# EAGLE design PecanPico6 (EAGLE 7.3.0)
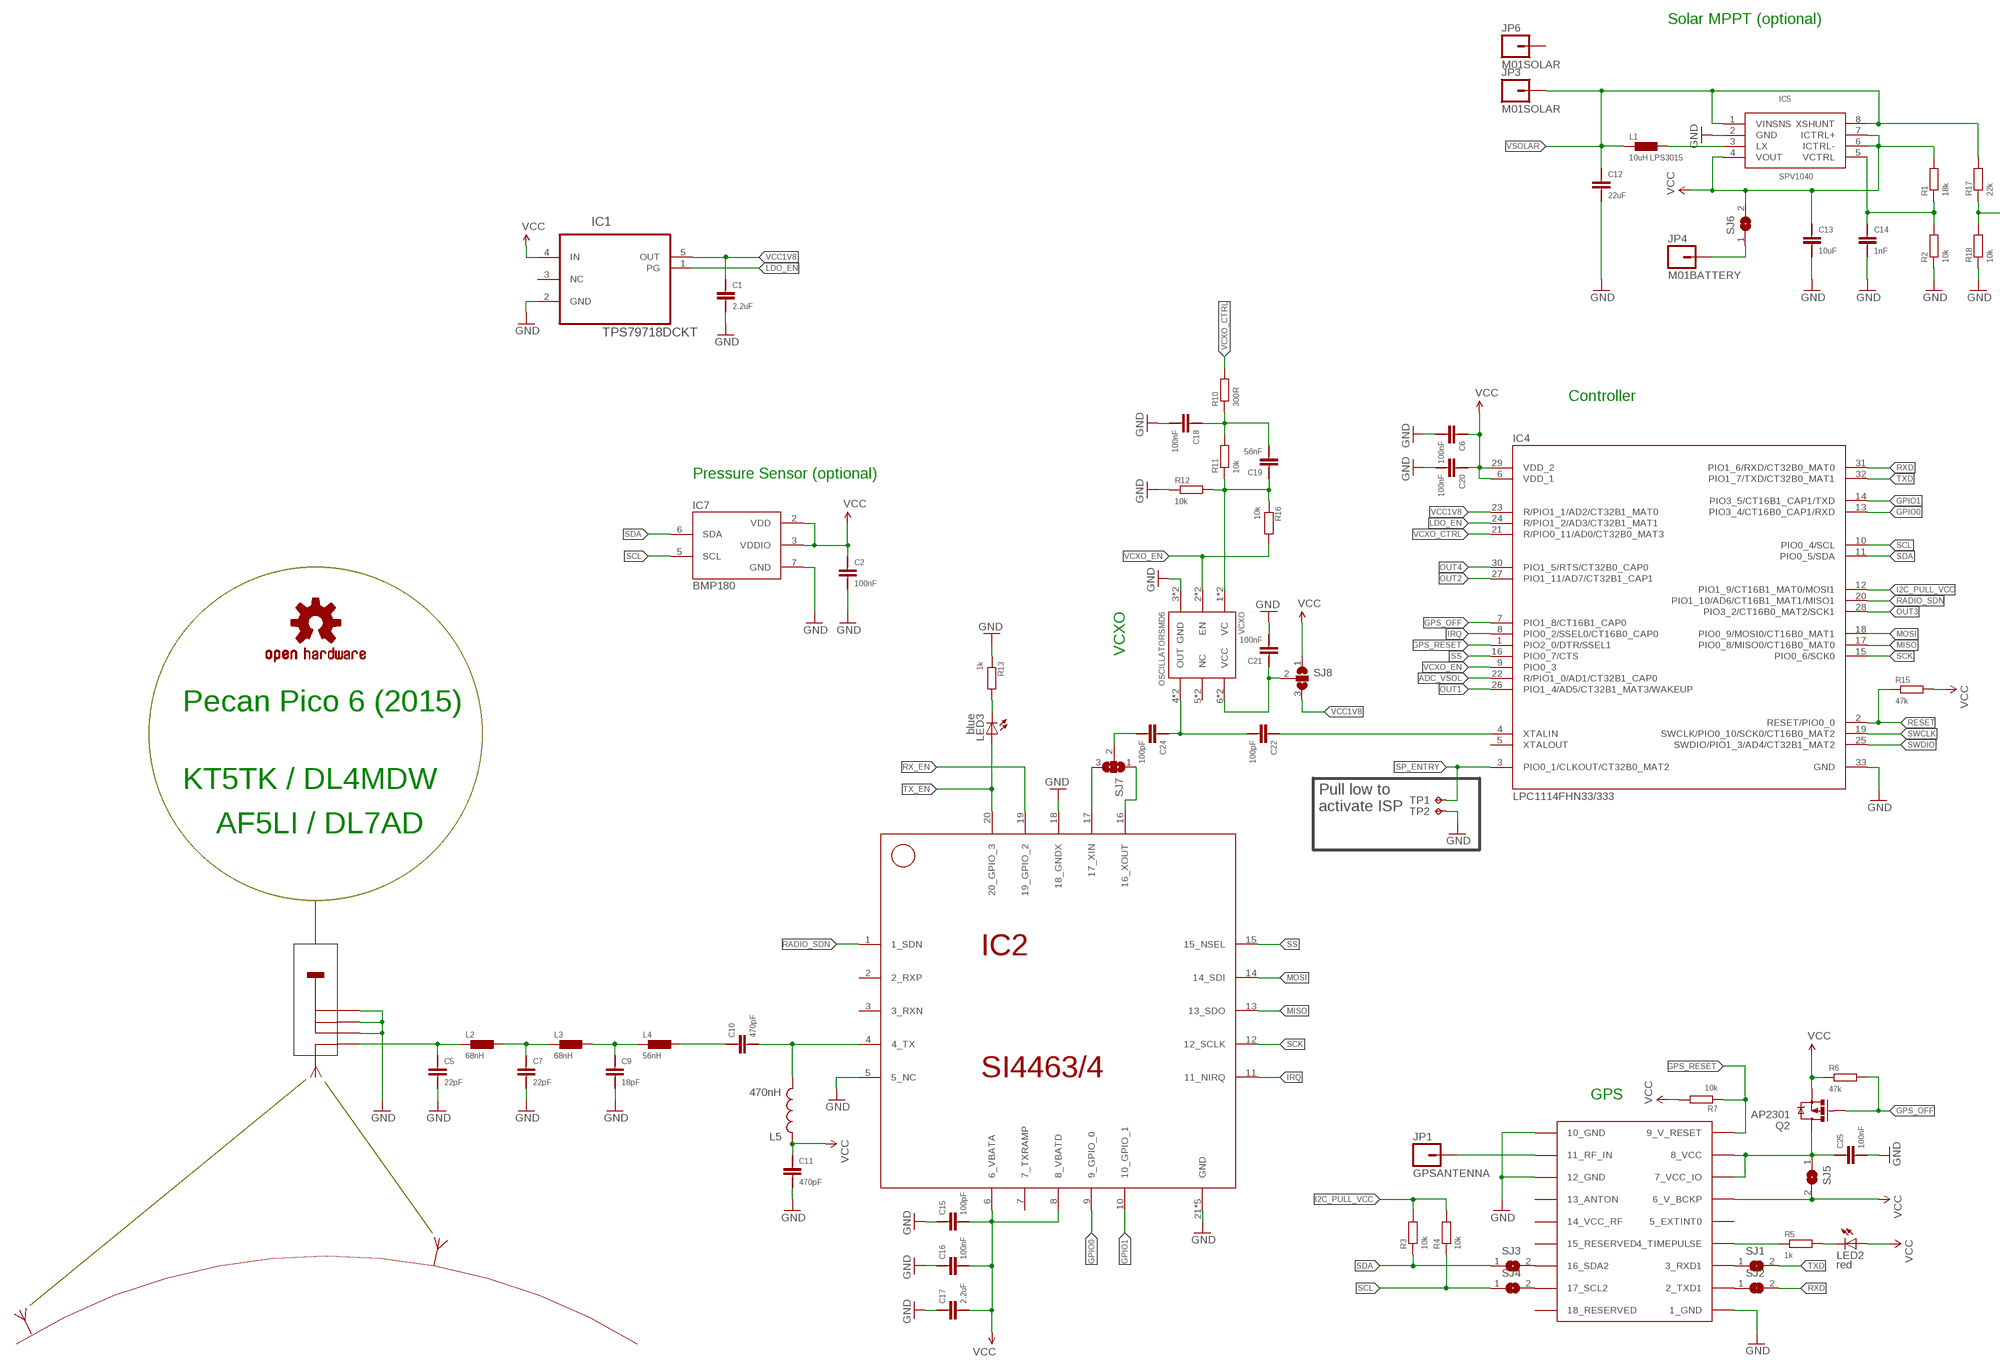
[diagram p0: schematic, sheet 1, part 1 of 2]
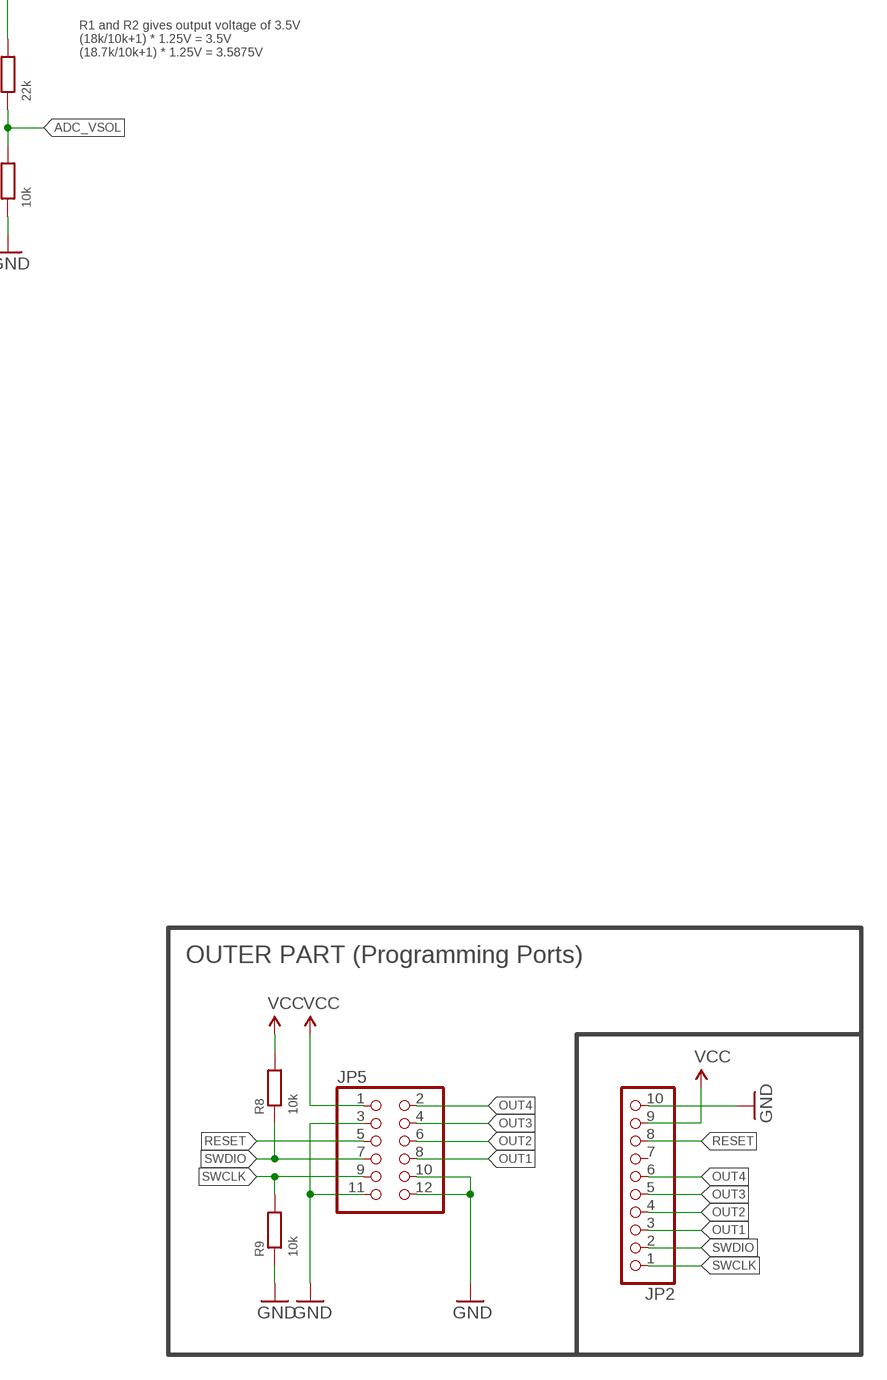
[diagram p1: schematic, sheet 1, part 2 of 2]

## Parts
C1  2.2uF  CAP-0603  [0603]
C2  100nF  CAP-0402  [0402]
C5  22pF  CAP-0402  [0402]
C6  100nF  CAP-0402  [0402]
C7  22pF  CAP-0402  [0402]
C9  18pF  CAP-0402  [0402]
C10  470pF  CAP-0402  [0402]
C11  470pF  CAP-0402  [0402]
C12  22uF  CAP-0805  [0805]
C13  10uF  CAP-0805  [0805]
C14  1nF  CAP-0402  [0402]
C15  100pF  CAP-0402  [0402]
C16  100nF  CAP-0402  [0402]
C17  2.2uF  CAP-0603  [0603]
C18  100nF  CAP-0402  [0402]
C19  56nF  CAP-0402  [0402]
C20  100nF  CAP-0402  [0402]
C21  100nF  CAP-0402  [0402]
C22  100pF  CAP-0402  [0402]
C24  100pF  CAP-0402  [0402]
C25  100nF  CAP-0402  [0402]
IC1  TPS79718DCKT  [SOT65P210X110-5N]
IC2  SI4463/4  [QFN-20]
IC3  UBLOX_MAX-6  [UBLOX_MAX-6]
IC4  LPC1114FHN33/333  [QFN65P700X700X100-33N]
IC5  SPV1040  [TSSOP8]
IC7  BMP180  [BMP180]
JP1  GPSANTENNA  M01SOLAR  [PAD2_1.8X0.9]
JP2  PINHD-1X10  [1_27X3_PINHEAD_1X10S]
JP3  M01SOLAR  [PAD2_1.8X0.9]
JP4  M01BATTERY  [PAD3.5X7.0]
JP5  PINHD-2X6  [2X06]
JP6  M01SOLAR  [PAD2_1.8X0.9]
L1  10uH LPS3015  IND-LPS3015  [LPS3015]
L2  68nH  IND-0402  [0402]
L3  68nH  IND-0402  [0402]
L4  56nH  IND-0402  [0402]
L5  470nH  INDUCTOR0805  [0805]
LED2  red  LED0603  [LED-0603]
LED3  blue  LED0603  [LED-0603]
LOGO1  OSHW-LOGOS  [OSHW-LOGO-S]
Q2  AP2301  MOSFET-PCHANNEL  [SOT23-3]
R1  18k  RES-0402  [0402]
R2  10k  RES-0402  [0402]
R3  10k  RES-0402  [0402]
R4  10k  RES-0402  [0402]
R5  1k  RES-0402  [0402]
R6  47k  RES-0402  [0402]
R7  10k  RES-0402  [0402]
R8  10k  RES-0402  [0402]
R9  10k  RES-0402  [0402]
R10  300R  RES-0402  [0402]
R11  10k  RES-0402  [0402]
R12  10k  RES-0402  [0402]
R13  1k  RES-0402  [0402]
R15  47k  RES-0402  [0402]
R16  10k  RES-0402  [0402]
R17  22k  RES-0402  [0402]
R18  10k  RES-0402  [0402]
SJ1  SJ  [SJ]
SJ2  SJ  [SJ]
SJ3  SJ  [SJ]
SJ4  SJ  [SJ]
SJ5  SJ  [SJ]
SJ6  SJ  [SJ]
SJ7  SJ2W  [SJ_2]
SJ8  SJ2W  [SJ_2]
TP1  TPTP07R  [TP07R]
TP2  TPTP07R  [TP07R]
U$1  ANTENNAPAD  [ANTENNAPAD]
VCXO  OSCILLATORSMD6  [CRYSTAL-SMD-7.5X5.2-6PIN]

## Nets
ADC_VSOL: IC4.22(R/PIO1_0/AD1/CT32B1_CAP0) R17.P$1 R18.P$2
GPIO0: IC2.9(9_GPIO_0) IC4.13(PIO3_4/CT16B0_CAP1/RXD)
GPIO1: IC2.10(10_GPIO_1) IC4.14(PIO3_5/CT16B1_CAP1/TXD)
GPS_OFF: IC4.7(PIO1_8/CT16B1_CAP0) Q2.1(G) R6.P$2
GPS_RESET: IC3.9_V_RESET IC4.1(PIO2_0/DTR/SSEL1) R7.P$1
I2C_PULL_VCC: IC4.12(PIO1_9/CT16B1_MAT0/MOSI1) R3.P$2 R4.P$2
IRQ: IC2.11(11_NIRQ) IC4.8(PIO0_2/SSEL0/CT16B0_CAP0)
ISP_ENTRY: IC4.3(PIO0_1/CLKOUT/CT32B0_MAT2) TP1.TP
LDO_EN: IC1.1(PG) IC4.24(R/PIO1_2/AD3/CT32B1_MAT1)
MISO: IC2.13(13_SDO) IC4.17(PIO0_8/MISO0/CT16B0_MAT0)
MOD1: C18.P$2 C19.P$1 R10.P$1 R11.P$2
MOSI: IC2.14(14_SDI) IC4.18(PIO0_9/MOSI0/CT16B0_MAT1)
N$1: C7.P$2 L2.P$2 L3.P$1
N$2: C24.P$1 SJ7.2
N$3: IC3.11_RF_IN JP1.1
N$4: C22.P$2 IC4.4(XTALIN)
N$6: LED2.C R5.P$2
N$7: JP4.1 SJ6.1
N$8: IC3.4_TIMEPULSE R5.P$1
N$9: LED3.C R13.P$2
N$10: IC2.17(17_XIN) SJ7.3
N$11: C25.P$2 IC3.7_VCC_IO IC3.8_VCC Q2.3(D) SJ5.1
N$13: C22.P$1 C24.P$2 VCXO.4(OUT) VCXO.4INNER(OUT)
N$14: C21.P$2 SJ8.2 VCXO.6(VCC) VCXO.6INNER(VCC)
N$15: IC3.3_RXD1 SJ1.1
N$17: IC2.16(16_XOUT) SJ7.1
N$20: IC3.2_TXD1 SJ2.1
N$21: C19.P$2 R11.P$1 R12.P$2 R16.P$1 VCXO.1(VC) VCXO.1INNER(VC)
N$23: C10.P$1 IC2.4(4_TX) L5.2
N$25: IC3.16_SDA2 SJ3.2
N$26: IC3.17_SCL2 SJ4.2
N$27: C10.P$2 L4.P$2
N$32: IC5.3(LX) L1.2_1 L1.2_2 L1.2_3 L1.2_4 L1.2_5 L1.2_6 L1.2_7 L1.2_8 L1.2_9
N$34: C9.P$2 L3.P$2 L4.P$1
N$35: C5.P$2 L2.P$1 U$1.ANT
N$36: C14.P$2 IC5.5(VCTRL) R1.P$1 R2.P$2
N$100: C1.P$1 C2.P$1 C5.P$1 C6.P$1 C7.P$1 C9.P$1 C11.P$1 C12.P$1 C13.P$1 C14.P$1 C15.P$2 C16.P$2 C17.P$2 C18.P$1 C20.P$1 C21.P$1 C25.P$1 IC1.2(GND) IC2.5(5_NC) IC2.18(18_GNDX) IC2.21(GND) IC2.22(GND) IC2.23(GND) IC2.24(GND) IC2.25(GND) IC3.1_GND IC3.10_GND IC3.12_GND IC4.33(GND) IC5.2(GND) IC7.7(GND) JP2.10 JP5.3 JP5.10 JP5.11 JP5.12 R2.P$1 R9.P$1 R12.P$1 R13.P$1 R18.P$1 TP2.TP U$1.GND1 U$1.GND2 U$1.GND3 VCXO.3(GND) VCXO.3INNER(GND) ; supply symbol labelled GND
OUT1: IC4.26(PIO1_4/AD5/CT32B1_MAT3/WAKEUP) JP2.3 JP5.8
OUT2: IC4.27(PIO1_11/AD7/CT32B1_CAP1) JP2.4 JP5.6
OUT3: IC4.28(PIO3_2/CT16B0_MAT2/SCK1) JP2.5 JP5.4
OUT4: IC4.30(PIO1_5/RTS/CT32B0_CAP0) JP2.6 JP5.2
RADIO_SDN: IC2.1(1_SDN) IC4.20(PIO1_10/AD6/CT16B1_MAT1/MISO1)
RESET: IC4.2(RESET/PIO0_0) JP2.8 JP5.5 R15.P$1
RX_EN: IC2.19(19_GPIO_2)
RXD: IC4.31(PIO1_6/RXD/CT32B0_MAT0) SJ2.2
SCK: IC2.12(12_SCLK) IC4.15(PIO0_6/SCK0)
SCL: IC4.10(PIO0_4/SCL) IC7.5(SCL) R4.P$1 SJ4.1
SDA: IC4.11(PIO0_5/SDA) IC7.6(SDA) R3.P$1 SJ3.1
SS: IC2.15(15_NSEL) IC4.16(PIO0_7/CTS)
SWCLK: IC4.19(SWCLK/PIO0_10/SCK0/CT16B0_MAT2) JP2.1 JP5.9 R9.P$2
SWDIO: IC4.25(SWDIO/PIO1_3/AD4/CT32B1_MAT2) JP2.2 JP5.7 R8.P$1
TX_EN: IC2.20(20_GPIO_3) LED3.A
TXD: IC4.32(PIO1_7/TXD/CT32B0_MAT1) SJ1.2
VCC1V8: C1.P$2 IC1.5(OUT) IC4.23(R/PIO1_1/AD2/CT32B1_MAT0) SJ8.3
VCC15: C2.P$2 C6.P$2 C11.P$2 C13.P$2 C15.P$1 C16.P$1 C17.P$1 C20.P$2 IC1.4(IN) IC2.6(6_VBATA) IC2.8(8_VBATD) IC3.6_V_BCKP IC4.6(VDD_1) IC4.29(VDD_2) IC5.4(VOUT) IC5.6(ICTRL-) IC5.7(ICTRL+) IC7.2(VDD) IC7.3(VDDIO) JP2.9 JP5.1 L5.1 LED2.A Q2.2(S) R1.P$2 R6.P$1 R7.P$2 R8.P$2 R15.P$2 SJ5.2 SJ6.2 SJ8.1 ; supply symbol labelled VCC
VCXO_CTRL: IC4.21(R/PIO0_11/AD0/CT32B0_MAT3) R10.P$2
VCXO_EN: IC4.9(PIO0_3) R16.P$2 VCXO.2(EN) VCXO.2INNER(EN)
VSOLAR: C12.P$2 IC5.1(VINSNS) IC5.8(XSHUNT) JP3.1 L1.1_1 L1.1_2 L1.1_3 L1.1_4 L1.1_5 L1.1_6 L1.1_7 L1.1_8 L1.1_9 R17.P$2
Unconnected: IC1.3(NC) IC2.2(2_RXP) IC2.3(3_RXN) IC2.7(7_TXRAMP) IC3.5_EXTINT0 IC3.13_ANTON IC3.14_VCC_RF IC3.15_RESERVED IC3.18_RESERVED IC4.5(XTALOUT) JP2.7 JP6.1 VCXO.5(NC) VCXO.5INNER(NC)

## Notes on the sheet
- Solar MPPT (optional)
- R1 and R2 gives output voltage of 3.5V
  (18k/10k+1) * 1.25V = 3.5V
  (18.7k/10k+1) * 1.25V = 3.5875V
- Controller
- Pressure Sensor (optional)
- VCXO
- Pecan Pico 6 (2015)
- OUTER PART (Programming Ports)
- KT5TK / DL4MDW
- Pull low to
- activate ISP
- AF5LI / DL7AD
- GPS

## Library data of the parts
C1 C17 = sven:CAP-0603; MF: ILLINOIS CAPACITOR,INC.; MPN: 225CKH250M; OC_NEWARK: 69K7918
C2 C5-C7 C9-C11 C14-C16 C18-C22 C24 C25 = sven:CAP-0402; OC_NEWARK: unknown
C12 C13 = sven:CAP-0805; OC_NEWARK: unknown
IC1 = sven:TPS79718DCKT: LDO Linear Regulators; MF: TEXAS INSTRUMENTS; MPN: TPS79718DCKT; OC_FARNELL: 1135377; OC_NEWARK: 77C1373; PACKAGE: SC-70-5; SUPPLIER: Texas Instruments
IC2 = KT5TK:SI4463/4; OC_NEWARK: unknown
IC3 = ava:UBLOX_MAX-6: UBLOX MAX-6; OC_NEWARK: unknown
IC4 = NXP_By_element14_Batch_1:LPC1114FHN33/333; OC_NEWARK: unknown
IC5 = SPV1040:SPV1040; OC_NEWARK: unknown
IC7 = SparkFun-Sensors:BMP180: BOSCH BMP180 DIGITAL BAROMETRIC PRESSURE SENSOR Web page: http://www.bosch-sensortec.com/en/homepage/products_3/environmental_sensors_1/bmp180_1/bmp180 Datasheet: http://ae-bst.resource.bosch.com/media/products/dokumente/bmp180/BST-BMP180-DS000-09.pdf The BMP180 is the function compatible successor of the BMP085, a new generation of high precision digital pressure sensors for consumer applications. The ultra-low power, low voltage electronics of the BMP180 is optimized for use in mobile phones, PDAs, GPS navigation devices and outdoor equipment. With a low altitude noise of merely 0.25m at fast conversion time, the BMP180 offers superior performance. The I2C interface allows for easy system integration with a microcontroller. The BMP180 is based on piezo-resistive technology for EMC robustness, high accuracy and linearity as well as long term stability. Key features: - Temperature measurement included - I2C interface - Fully calibrated - Pb-free, halogen-free and RoHS compliant, - MSL 1 Basic specs: Pressure range: 300 to 1100hPa (+9000m to -500m relating to sea level) Supply voltage: 1.8 to 3.6V (VDD), 1.62V to 3.6V (VDDIO) Package: LGA package with metal lid Small footprint: 3.6mm x 3.8mm Super-flat: 0.93mm height Low power: 5μA at 1 sample / sec. in standard mode Low noise: 0.06hPa (0.5m) in ultra low power mode, 0.02hPa (0.17m) advanced resolution mode Typical applications: - Enhancement of GPS navigation (dead-reckoning, slope detection, etc.) - In- and out-door navigation - Leisure and sports - Weather forecast - Vertical velocity indication (rise/sink speed); OC_NEWARK: unknown
JP1 JP3 JP4 JP6 = sven:M01: Header 1 Standard 1-pin 0.1" header. Use with straight break away headers (SKU : PRT-00116), right angle break away headers (PRT-00553), swiss pins (PRT-00743), machine pins (PRT-00117), and female headers (PRT-00115).; OC_NEWARK: unknown
JP2 = PecanPico5a:PINHD-1X10: PIN HEADER; OC_NEWARK: unknown
JP5 = pinhead:PINHD-2X6: PIN HEADER; OC_NEWARK: unknown
L1 = PecanFemto4:IND-LPS3015; OC_NEWARK: unknown
L2-L4 = sven:IND-0402; OC_NEWARK: unknown
L5 = SparkFun-Passives:INDUCTOR: Inductors Basic Inductor/Choke - 0603 and 1206. Footprints are not proven and vary greatly between part numbers. SRN6045- 33uH, 20% 1.4A SDR0403-560KL - 56uH, 10%, 500mA RMS/740mA peak; OC_NEWARK: unknown
LED2 LED3 = SparkFun:LED: LEDs Standard schematic elements and footprints for 5mm, 3mm, 1206, and 0603 sized LEDs. 5mm - Spark Fun Electronics SKU : COM-00529 (and others); OC_NEWARK: unknown
LOGO1 = SparkFun-Aesthetics:OSHW-LOGO: Open Source Hardware Logo This logo indicates the piece of hardware it is found on incorporates a OSHW license and/or adheres to the definition of open source hardware found here: http://freedomdefined.org/OSHW; OC_NEWARK: unknown
Q2 = SparkFun-DiscreteSemi:MOSFET-PCHANNEL: Generic PMOSFET IRLML2244 - TRANS-11153 (SOT-23 -20V -4.3A) (1.Gate 2.Source 3.Drain) FQP27P06 - COM-10349 <http://www.sparkfun.com/products/10349> (TO-220 -60V -27A) (1.Gate 2.Source 3.Drain); OC_NEWARK: unknown; PROD_ID: TRANS-08285
R1-R13 R15-R18 = sven:RES-0402; OC_NEWARK: unknown
SJ1-SJ6 = jumper:SJ: SMD solder JUMPER; OC_NEWARK: unknown
SJ7 SJ8 = jumper:SJ2W: SMD solder JUMPER; OC_NEWARK: unknown
TP1 TP2 = testpad:TP: Test pad; OC_NEWARK: unknown
U$1 = sven:ANTENNAPAD; OC_NEWARK: unknown
VCXO = SparkFun-FreqCtrl_TK:OSCILLATOR: Generic 5x3 and 7x5 oscillators; OC_NEWARK: unknown

## Net classes
0 default: width 0.15 mm, drill 0.3 mm, clearance 0.152 mm
1 vcc: width 0.254 mm, drill 0.3 mm, clearance 0.152 mm

## Board
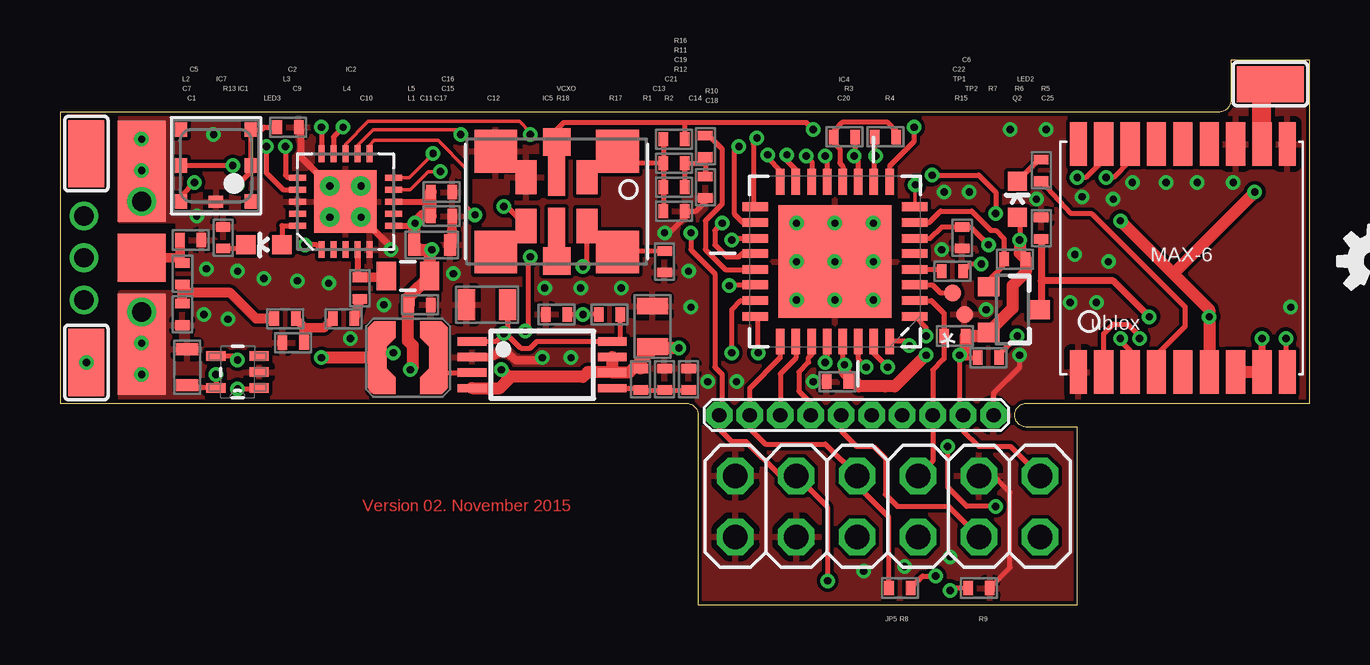
[diagram p2: board, top side]
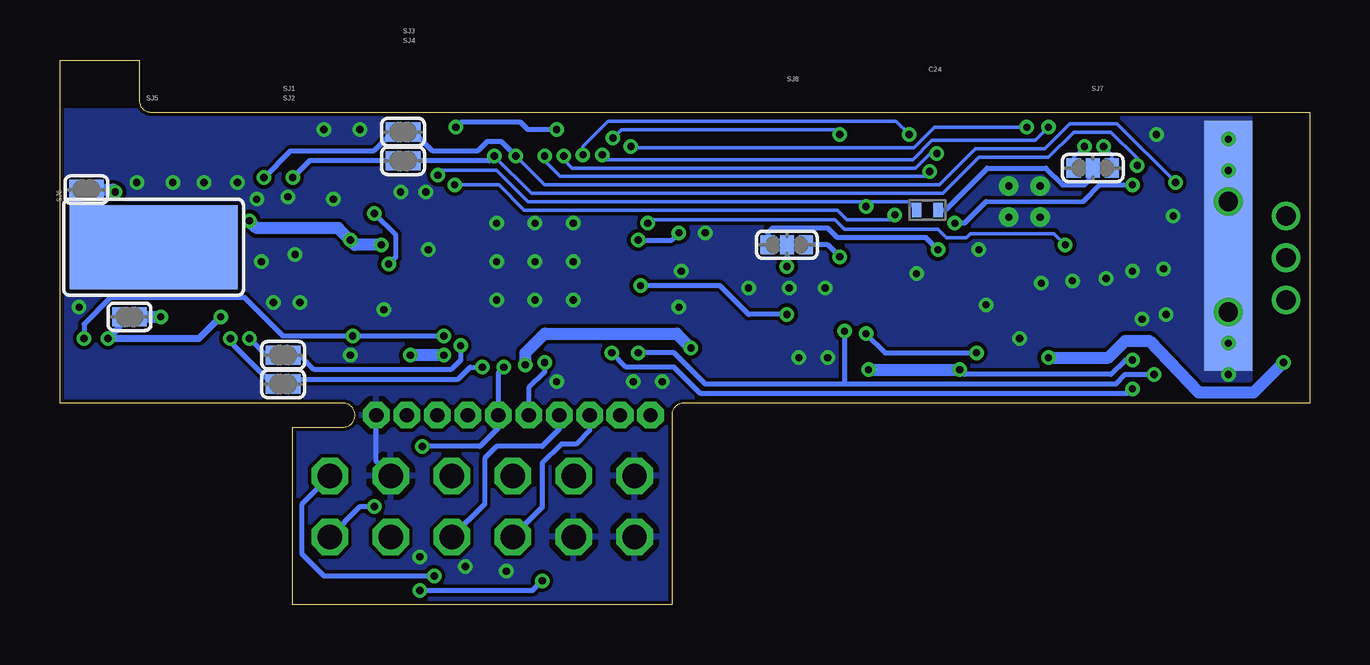
[diagram p3: board, bottom side, seen from below]

Size 52.1 x 22.7 mm. Coordinates in mm from the lower left corner, seen from the top.
Outline: 0,8.4 26.1,8.4 arc-90 26.6,7.9 26.6,0 42.4,0 42.4,7.4 40.3,7.4 arc-90 39.8,7.9 arc-90 40.3,8.4 52.1,8.4 52.1,22.7 48.8,22.7 48.8,21.03 arc-90 48.3,20.52 0,20.52 0,8.4
Copper layers (1*16): Top 0.035mm / dielectric 1.5mm / Bottom 0.035mm
Design rules "hackvana *": minimum track width 0.15mm, minimum drill 0.3mm, track to track 6mil, track to pad 6mil, pad to pad 6mil, via to via 6mil, smd to smd 0mil, copper to edge 6mil, drill to drill 6mil, minimum pad ring 10mil, minimum via ring 6mil, stop-mask expansion 2mil, vias tented up to drill 100mil, thermal gap 10mil

### Footprints (pad centres in the part's own frame; a part is rotated, then mirrored left to right if it is on the bottom)
0603 = smd 0.5 x 0.9: P$1 -0.75,0; P$2 0.75,0
0402 = smd 0.4 x 0.6: P$1 -0.45,0; P$2 0.45,0
0805 = smd 0.7 x 1.3: P$1 -0.85,0; P$2 0.85,0
SOT65P210X110-5N = smd 0.8 x 0.4: 1 -0.9,0.66; 2 -0.9,0; 3 -0.9,-0.66; 4 0.9,-0.66; 5 0.9,0.66
QFN-20 = smd 0.7 x 0.25: 1 -2,1; 2 -2,0.5; 3 -2,0; 4 -2,-0.5; 5 -2,-1; 11 2,-1; 12 2,-0.5; 13 2,0; 14 2,0.5; 15 2,1 | smd 0.25 x 0.7: 6 -1,-2; 7 -0.5,-2; 8 0,-2; 9 0.5,-2; 10 1,-2; 16 1,2; 17 0.5,2; 18 0,2; 19 -0.5,2; 20 -1,2 | smd 2.6 x 2.6: 21 0,0 | drill 0.305: 22 -0.65,0.65; 23 0.65,0.65; 24 0.65,-0.65; 25 -0.65,-0.65
UBLOX_MAX-6 = smd 1.8 x 0.7: 1_GND 4.95,-4.4; 9_V_RESET 4.95,4.3; 10_GND -4.55,4.3; 18_RESERVED -4.55,-4.4 | smd 1.8 x 0.8: 2_TXD1 4.95,-3.35; 3_RXD1 4.95,-2.25; 4_TIMEPULSE 4.95,-1.15; 5_EXTINT0 4.95,-0.05; 6_V_BCKP 4.95,1.05; 7_VCC_IO 4.95,2.15; 8_VCC 4.95,3.25; 11_RF_IN -4.55,3.25; 12_GND -4.55,2.15; 13_ANTON -4.55,1.05; 14_VCC_RF -4.55,-0.05; 15_RESERVED -4.55,-1.15; 16_SDA2 -4.55,-2.25; 17_SCL2 -4.55,-3.35
QFN65P700X700X100-33N = smd 1.067 x 0.356: 1 -3.327,2.286; 2 -3.327,1.626; 3 -3.327,0.965; 4 -3.327,0.33; 5 -3.327,-0.33; 6 -3.327,-0.965; 7 -3.327,-1.626; 8 -3.327,-2.286; 17 3.327,-2.286; 18 3.327,-1.626; 19 3.327,-0.965; 20 3.327,-0.33; 21 3.327,0.33; 22 3.327,0.965; 23 3.327,1.626; 24 3.327,2.286 | smd 0.356 x 1.067: 9 -2.286,-3.327; 10 -1.626,-3.327; 11 -0.965,-3.327; 12 -0.33,-3.327; 13 0.33,-3.327; 14 0.965,-3.327; 15 1.626,-3.327; 16 2.286,-3.327; 25 2.286,3.327; 26 1.626,3.327; 27 0.965,3.327; 28 0.33,3.327; 29 -0.33,3.327; 30 -0.965,3.327; 31 -1.626,3.327; 32 -2.286,3.327 | smd 4.699 x 4.699: 33 0,0
TSSOP8 = smd 1.2 x 0.35: 1 -2.925,0.975; 2 -2.925,0.325; 3 -2.925,-0.325; 4 -2.925,-0.975; 5 2.925,-0.975; 6 2.925,-0.325; 7 2.925,0.325; 8 2.925,0.975
BMP180 = smd 0.6 x 0.5: 1 1.5,1.45; 2 0,1.45; 3 -1.5,1.45; 4 -1.5,-1.45; 5 0,-1.45; 6 1.5,-1.45 | smd 0.5 x 0.6: 7 1.5,0
PAD2_1.8X0.9 = smd 2.8 x 1.5: 1 0,0
1_27X3_PINHEAD_1X10S = drill 0.6 pad 0.914 octagon: 1 0,5.715; 2 0,4.445; 3 0,3.175; 4 0,1.905; 5 0,0.635; 6 0,-0.635; 7 0,-1.905; 8 0,-3.175; 9 0,-4.445; 10 0,-5.715
PAD3.5X7.0 = smd 3.5 x 7: 1 0,0
2X06 = drill 1.016 octagon: 1 -6.35,-1.27; 2 -6.35,1.27; 3 -3.81,-1.27; 4 -3.81,1.27; 5 -1.27,-1.27; 6 -1.27,1.27; 7 1.27,-1.27; 8 1.27,1.27; 9 3.81,-1.27; 10 3.81,1.27; 11 6.35,-1.27; 12 6.35,1.27
LPS3015 = smd 0.762 x 2.54: 1_1 -1.27,0; 2_1 1.27,0 | smd 0.889 x 0.254: 1_2 -0.953,-1.397; 1_3 -0.953,1.397; 2_2 0.953,-1.397; 2_3 0.953,1.397 | smd 0.381 x 0.445: 1_4 -0.699,-1.048; 1_5 -0.699,1.048; 2_4 0.699,-1.048; 2_5 0.699,1.048 | smd 0.359 x 0.359 rotated 45: 1_6 -1.398,-1.271; 1_7 -1.398,1.271 | smd 0.538 x 0.538 rotated 45: 1_8 -0.889,-0.823; 1_9 -0.889,0.823 | smd 0.359 x 0.359 rotated 225: 2_6 1.398,-1.271; 2_7 1.398,1.271 | smd 0.538 x 0.538 rotated 225: 2_8 0.889,-0.823; 2_9 0.889,0.823
0805' = smd 0.8 x 1.2: 1 -0.9,0; 2 0.9,0
LED-0603 = smd 0.8 x 0.8: A 0,-0.75; C 0,0.75
SOT23-3 = smd 0.8 x 0.9: 1 -0.95,-1; 2 0.95,-1; 3 0,1.1
SJ = smd 0.584 x 0.8: 1 -0.432,0; 2 0.432,0
SJ_2 = smd 0.584 x 0.8: 1 -0.8,0; 2 0,0; 3 0.8,0
TP07R = smd 0.7 x 0.7: TP 0,0
ANTENNAPAD = smd 2 x 2: ANT 0,0 | smd 4.2 x 2: GND1 -3.6,0; GND2 3.6,0 | smd 10.4 x 2 bottom: GND3 0.5,0
CRYSTAL-SMD-7.5X5.2-6PIN = smd 1.778 x 1.778: 1 -2.54,-2.1; 3 2.54,-2.1; 4 2.54,2.1; 6 -2.54,2.1 | smd 0.889 x 1.422: 1INNER -1.27,-1.016; 3INNER 1.27,-1.016; 4INNER 1.27,1.016; 6INNER -1.27,1.016 | smd 1.143 x 1.143: 2 0,-2.481; 5 0,2.481 | smd 0.711 x 1.778: 2INNER 0,-1.143; 5INNER 0,1.143

### Placement (x,y rotation side)
C1  5.3,9.9 270 top
C2  9.5,19.9 180 top
C5  5.45,15.2 180 top
C6  37.6,15.3 90 top
C7  5.1,12.1 90 top
C9  9.72,10.92 0 top
C10  12.5,13.2 270 top
C11  15,12.5 180 top
C12  17.8,12.5 0 top
C13  24.7,11.6 270 top
C14  26.2,9.4 270 top
C15  15.9,16.2 0 top
C16  15.9,17.2 0 top
C17  15.5,15 0 top
C18  26.9,17.4 90 top
C19  25.6,17.4 180 top
C20  32.4,9.3 0 top
C21  25.2,14.3 90 top
C22  37.2,13.9 180 top
C24  15.95,16.45 180 bottom
C25  40.9,15.7 270 top
IC1  7.4,9.7 180 top
IC2  11.9,16.8 90 top
IC3  46.85,14.65 270 top
IC4  32.3,14.3 180 top
IC5  20.1,10 0 top
IC7  6.5,18.3 270 top
JP1  50.45,21.7 0 top
JP2  33.2,7.9 90 top
JP3  1.1,10.1 90 top
JP4  48.2,14.9 90 bottom
JP5  34.5,4.1 180 top
JP6  1.1,18.8 90 top
L1  14.5,10.3 0 top
L2  5.1,13.8 270 top
L3  9.38,11.92 0 top
L4  11.82,11.92 0 top
L5  470nH  [0805']  14.5,13.7 180 top
LED2  39.9,16.9 0 top
LED3  8.5,15 90 top
LOGO1  54.74,14.32 0 top
Q2  39.7,12.3 270 top
R1  24.2,9.4 90 top
R2  25.2,9.4 270 top
R3  32.7,19.5 180 top
R4  34.4,19.5 0 top
R5  40.9,18.1 90 top
R6  39.8,14.4 180 top
R7  38.7,10.3 180 top
R8  35,0.7 0 top
R9  38.3,0.7 180 top
R10  26.9,19.1 90 top
R11  25.6,18.4 0 top
R12  25.6,16.4 180 top
R13  6.8,15.3 270 top
R15  37.3,11.2 0 top
R16  25.6,19.4 0 top
R17  22.9,12.1 0 top
R18  20.7,12.1 0 top
SJ1  42.8,10.4 0 bottom
SJ2  42.8,9.2 0 bottom
SJ3  37.8,19.7 180 bottom
SJ4  37.8,18.5 180 bottom
SJ5  49.2,12 0 bottom
SJ6  51,17.3 0 bottom
SJ7  9.05,18.2 0 bottom
SJ8  21.8,15 0 bottom
TP1  37.2,13 0 top
TP2  37.7,12.1 0 top
U$1  3.4,14.46 90 top
VCXO  20.7,16.8 180 top

### Tracks (layer width: path | path; a pad name or v marks a point on that pad's centre or on a via)
ADC_VSOL  (via drill 0.3)
  Top 0.2: R18.P$2 v21.8,12.1 R17.P$1 | v27.9,13.3 27.93,13.33 IC4.22
  Bottom 0.2: v21.8,12.1 23.4,12.1 24.6,13.3 v27.9,13.3
GPIO0  (via drill 0.3)
  Top 0.15: v15.85,18.05 15.35,18.05 14.6,17.3 IC2.9
  Top 0.2: IC4.13 31.97,18.63 v31.9,18.7
  Bottom 0.15: v31.9,18.7 31.9,18.5 31.25,17.85 16.05,17.85 v15.85,18.05
GPIO1  (via drill 0.3)
  Top 0.15: v15.55,18.8 14.55,17.8 IC2.10
  Top 0.2: v31.1,18.7 31.34,18.46 IC4.14
  Bottom 0.15: v15.55,18.8 15.85,18.8 16.45,18.2 30.75,18.2 31.1,18.55 v31.1,18.7
GPS_OFF
  Top 0.2: Q2.1 38.8,13.6 39.25,14.05 R6.P$2 39.35,15.25 39,15.6 38.8,15.6 38,16.4 36.7,16.4 36.23,15.93 IC4.7
GPS_RESET  (via drill 0.3)
  Top 0.2: v51.1,11.1 51.1,9.75 IC3.9_V_RESET | R7.P$1 39.15,10.45 v39.9,11.2 | IC4.1 36.1,11.54 v36.1,11.2
  Bottom 0.2: v36.1,11.2 v39.9,11.2 42.8,11.2 44.4,12.8 50,12.8 51.1,11.7 v51.1,11.1
I2C_PULL_VCC
  Top 0.2: R4.P$2 34.85,19.75 34.5,20.1 32.6,20.1 32.25,19.75 R3.P$2 32.25,19.25 32.5,19 32.5,18.4 32.63,18.27 IC4.12
IRQ  (via drill 0.3)
  Top 0.15: IC2.11 12.9,19.15 13.1,19.35 15.75,19.35 16.95,18.15 16.95,16.6 v17.3,16.25 | v35.65,17.5 35.63,17.48 IC4.8
  Bottom 0.15: v17.3,16.25 17.5,16.05 19.3,16.05 19.7,16.45 32.75,16.45 33.8,17.5 v35.65,17.5
ISP_ENTRY
  Top 0.2: IC4.3 36.37,13.33 36.7,13 TP1.TP
LDO_EN  (via drill 0.3)
  Top 0.2: v29.1,10.5 29.1,11.89 IC4.24 | v7.4,9 8.24,9 IC1.1
  Bottom 0.2: v29.1,10.5 28.5,9.9 26.5,9.9 25.4,8.8 7.6,8.8 v7.4,9
MISO  (via drill 0.3)
  Top 0.15: IC2.13 11.9,19.2 12.85,20.15 19.15,20.15 19.6,19.7 v19.6,19.6
  Top 0.2: v29.05,19.45 28.9,19.2 28.9,16.59 IC4.17
  Bottom 0.15: v19.6,19.6 19.8,19.8 28.7,19.8 v29.05,19.45
MOD1
  Top 0.2: 26.9,18.4 C18.P$2 | C19.P$1 R11.P$2 26.9,18.4 | 26.9,18.4 R10.P$1
MOSI  (via drill 0.3)
  Top 0.2: v11.8,19.9 11.4,19.5 IC2.14 | v28.3,19.1 28.1,18.9 28.1,16.3 28.47,15.93 IC4.18
  Bottom 0.15: v28.3,19.1 28.25,19.05 16.5,19.05 15.65,19.9 v11.8,19.9
N$1
  Top 0.4: C7.P$2 5.1,13
  Top 0.406: L3.P$1 8.17,11.92 7.1,13 5.1,13 L2.P$2
N$2
  Bottom 0.15: 9.05,18.05 SJ7.2
  Bottom 0.2: SJ7.2 9.05,17.85 9.4,17.5 10.3,17.5 11,18.2 13.45,18.2 15.2,16.45 C24.P$1
N$3
  Top 0.8: IC3.11_RF_IN 50.1,21.7 JP1.1
N$4
  Top 0.2: C22.P$2 36.62,13.97 IC4.4
N$6
  Top 0.2: R5.P$2 40.8,18.55 LED2.C
N$7
  Bottom 0.5: SJ6.1 51.43,14.9 JP4.1
N$8
  Top 0.2: R5.P$1 42.15,16.3 43,16.3 46.9,12.4 46.9,11.6 45.7,10.4 IC3.4_TIMEPULSE
N$9
  Top 0.2: R13.P$2 7.75,14.85 LED3.C
N$10  (via drill 0.3)
  Top 0.2: v8.6,19.1 8.6,18 9.3,17.3 IC2.17
  Bottom 0.15: SJ7.3 8.25,18.75 v8.6,19.1
N$11  (via drill 0.3)
  Top 0.3: C25.P$2 40.9,13.5 | 40.9,13.5 40.9,12.4 Q2.3 | v50.1,11.1 IC3.8_VCC | v45.4,12 43.9,13.5 40.9,13.5
  Top 0.5: IC3.8_VCC IC3.7_VCC_IO
  Bottom 0.3: SJ5.1 49.63,11.57 v50.1,11.1 46.3,11.1 v45.4,12
N$13  (via drill 0.3)
  Top 0.2: 18.1,15.1 VCXO.4 18.16,15.34 19.43,15.34 VCXO.4INNER 18.61,16.6 v18.5,16.6 | v38.4,14.2 37.95,14.2 C22.P$1 | v36.35,17.9 38.3,17.9 39,17.2 v39,16.3
  Bottom 0.15: 18.5,16.8 32.6,16.8 33.9,18.1 36.15,18.1 v36.35,17.9 | 18.5,16.8 16.75,16.8 C24.P$2 | v18.5,16.6 18.5,16.8
  Bottom 0.2: v38.4,14.2 38.1,14.5 38.1,15.4 v39,16.3
N$14  (via drill 0.3)
  Top 0.2: v21.8,14.1 21.97,14.27 VCXO.6INNER 23.05,14.7 VCXO.6 23.29,14.75 C21.P$2
  Bottom 0.2: 21.8,15.3 SJ8.2 v21.8,14.1
N$15  (via drill 0.3)
  Top 0.2: v44.2,11.1 44.2,11 44.6,10.6 IC3.3_RXD1
  Bottom 0.2: SJ1.1 43.5,10.4 v44.2,11.1
N$16  (via drill 0.8)
  other vias: 1,12.7
N$17  (via drill 0.3)
  Top 0.2: v9.4,19.1 9.4,17.9 9.5,17.8 IC2.16
  Bottom 0.15: SJ7.1 9.85,18.65 v9.4,19.1
N$18  (via drill 0.8)
  other vias: 1,14.46
N$19  (via drill 0.8)
  other vias: 1,16.2
N$20  (via drill 0.3)
  Top 0.2: IC3.2_TXD1 43.5,11.3 43.9,11.7 44.5,11.7 45,11.2 v45,11.1
  Bottom 0.2: SJ2.1 45,10.97 v45,11.1
N$21
  Top 0.2: VCXO.1INNER VCXO.1 23.24,18.4 R11.P$1 | R16.P$1 R11.P$1 | R11.P$1 C19.P$2 R12.P$2
N$23
  Top 0.25: IC2.4 12.4,13.65 C10.P$1
  Top 0.4: C10.P$1 13.5,13.65 L5.2
N$25  (via drill 0.3)
  Top 0.2: IC3.16_SDA2 44.6,18.5 43.9,17.8 v43.6,17.8
  Bottom 0.2: SJ3.2 39.03,18.9 42.5,18.9 v43.6,17.8
N$26  (via drill 0.3)
  Top 0.2: IC3.17_SCL2 43.5,18.55 42.75,17.8 v42.4,17.8
  Bottom 0.2: SJ4.2 41.7,18.5 v42.4,17.8
N$27
  Top 0.4: C10.P$2 L4.P$2
N$32
  Top 0.2: L1.2_7 L1.2_3 L1.2_5 L1.2_9 L1.2_1 | L1.2_1 L1.2_8 L1.2_4 L1.2_2 L1.2_6 | L1.2_1 15.97,9.67 IC5.3
N$34
  Top 0.4: L4.P$1 11,11.55 10.2,11.55 | 10.2,11.55 L3.P$2 | 10.2,11.55 10.17,11.52 C9.P$2
N$35
  Top 0.4: C5.P$2 5,14.25 L2.P$1 4.89,14.46 U$1.ANT
N$36
  Top 0.2: IC5.5 24.12,9.02 R1.P$1 R2.P$2 C14.P$2
N$100  (via drill 0.3, 0.8)
  Top 0.2: v25.2,15.5 25.4,15.5 26.05,16.15 R12.P$1 26.5,16.4 26.9,16.8 C18.P$1 | v40,10.4 40,9.9 38.92,8.81 JP2.10 | R9.P$1 39.6,1.55 39.6,4.7 38.93,5.37 JP5.3
  Top 0.3: IC2.23 10.05,18.65 10.05,19.8 C2.P$1 | IC2.24 IC2.21 IC2.25 13.8,14.9
  Top 0.35: IC5.2 17.93,10.32 18.5,10.6 19,10.2 20,10.2 v20.1,10.3
  Top 0.4: 13.8,14.9 v13.8,14.8 | C15.P$2 16.35,15.1 C17.P$2
  Bottom 0.2: JP5.3 38.92,5.98 JP2.10
  other vias: 32.3,14.3 30.7,12.7 32.3,12.7 33.9,12.7 33.9,14.3 30.7,14.3 32.3,15.9 33.9,15.9 37.9,17.2 28.2,9.3 27,9.3 20.2,13.2 23.4,13.2 26.3,12.4 26.2,13.9 36.85,17.2 42.6,17 48.9,17.6 47.4,17.6 46.1,17.6 51.3,12.4 5.7,16.2 16.4,13.8 13.5,12.5 6.4,19.6 36.75,14.8 40.7,16.9 44.7,17.6 21.7,13.2 21.3,10.3 30.7,15.9 31.4,9.3 35.2,1.6 37.1,2 33.5,1.4 43.9,16.9 39.6,19.8 41.1,19.8 3.4,12.2 3.4,10.9 3.4,16.8 3.4,18.1 3.4,19.4 42.3,14.6 43.2,12.6 42.1,12.6 38.6,12.3 43.7,14.3 3.4,9.6 11.2,13.4 9.9,13.5 8.5,13.6 6.1,14 6,12.1 7,11.9 7.4,13.9 12.1,11.1
  pour Top: 2.5,8.4 26.1,8.4 arc-90 26.6,7.9 26.6,0 42.4,0 42.4,7.4 40.3,7.4 arc-90 39.8,7.9 arc-90 40.3,8.4 52.1,8.4 52.1,20.6 2.5,20.6 2.5,16 4.9,16 4.9,13 2.5,13
  pour Bottom: 2.5,8.4 26.1,8.4 arc-90 26.6,7.9 26.6,0 42.4,0 42.4,7.4 40.3,7.4 arc-90 39.8,7.9 arc-90 40.3,8.4 52.1,8.4 52.1,20.6 2.5,20.6
OUT1
  Top 0.2: IC4.26 30.67,10.27 30.02,9.62 JP2.3
  Bottom 0.2: JP2.3 30.02,7.28 30.6,6.7 31.2,6.7 32,5.9 32,4.06 JP5.8
OUT2
  Top 0.2: JP2.4 31.29,8.4 30.8,8.9 30.8,9.7 31.2,10.1 31.2,10.3 31.34,10.43 IC4.27
  Bottom 0.2: JP2.4 31.29,7.31 32,6.6 33.9,6.6 34.4,6.1 34.4,4.2 JP5.6
OUT3  (via drill 0.3)
  Top 0.2: IC4.28 31.97,10.17 v31.9,10.1 | JP2.5 32.56,7.24 33.2,6.6 33.9,6.6 34.4,6.1 34.4,4.6 34.9,4.1 37.04,4.1 JP5.4
  Bottom 0.2: v31.9,10.1 31.9,9.7 32.56,9.04 JP2.5
OUT4  (via drill 0.3)
  Top 0.2: IC4.30 33.27,10.23 v33.6,9.9 | v39,4.1 37.8,4.1 37,4.9 v37,6.6
  Bottom 0.2: v33.6,9.9 33.84,9.66 JP2.6 33.84,7.37 34.6,6.6 v37,6.6 | JP5.2 39.58,4.1 v39,4.1
RADIO_SDN  (via drill 0.3)
  Top 0.2: IC2.1 10.7,15 v10.2,15 | v27.6,15.9 27.3,15.6 27.3,15 27.8,14.5 28.3,14.5 28.43,14.63 IC4.20
  Bottom 0.15: v27.6,15.9 27.45,16.05 19.8,16.05 19.4,15.65 15.5,15.65 15.15,15.3 14.32,15.3 14.15,15.47 10.67,15.47 v10.2,15
RESET
  Top 0.2: IC4.2 36.33,12.67 36.85,12.15 R15.P$1 36.85,10.25 36.38,9.77 JP2.8 36.38,5.98 JP5.5
RXD  (via drill 0.3)
  Top 0.2: v34.5,9.9 33.93,10.47 IC4.31
  Bottom 0.2: v34.5,9.9 35,9.9 35.5,9.4 42.17,9.4 SJ2.2
SCK  (via drill 0.3)
  Top 0.15: IC2.12 12.4,19.15 13.05,19.8 16.5,19.8 v16.7,19.6
  Top 0.2: v30.3,18.75 30.3,18.5 30.67,18.13 IC4.15
  Bottom 0.15: v16.7,19.6 17.25,20.15 29.25,20.15 30.3,19.1 v30.3,18.75
SCL  (via drill 0.3)
  Top 0.2: IC4.10 33.93,18.63 v34,18.7 33.95,18.75 R4.P$1 | v7.2,18.3 IC7.5
  Bottom 0.15: v7.2,18.3 7.2,18.6 8.3,19.7 9.85,19.7 10.9,18.65 13.8,18.65 15.3,17.15 32.45,17.15 v34,18.7
  Bottom 0.2: v34,18.7 34.2,18.5 SJ4.1
SDA  (via drill 0.3)
  Top 0.2: IC4.11 33.27,18.54 v33.1,18.7 33.15,18.75 R3.P$1 | v5.6,17.6 5.05,17.05 IC7.6
  Bottom 0.15: v5.6,17.6 8.05,20.05 10,20.05 11.05,19 13.95,19 15.45,17.5 31.9,17.5 v33.1,18.7
  Bottom 0.2: v33.1,18.7 33.7,19.3 34.3,19.3 34.7,18.9 36.57,18.9 SJ3.1
SS  (via drill 0.3)
  Top 0.2: IC4.16 | 29.99,17.6 IC4.16 | v10.9,19.9 IC2.15 | v29.5,18.75 29.5,18.6 30.01,18.09 IC4.16
  Bottom 0.15: v10.9,19.9 11.45,19.35 15.75,19.35 16.55,18.55 29.3,18.55 v29.5,18.75
SWCLK  (via drill 0.3)
  Top 0.2: v26.3,15.5 26.3,14.8 27.3,13.8 27.3,9.9 27.6,9.6 27.6,8.01 JP2.1 27.48,7.32 28,6.8 28.6,6.8 30.03,5.37 JP5.9 32,4.06 v32,1 | v28,15.2 28.06,15.26 IC4.19 | R9.P$2 37.2,0.7 v37.1,0.6
  Bottom 0.2: v28,15.2 26.6,15.2 v26.3,15.5 | v37.1,0.6 32.4,0.6 v32,1
SWDIO
  Top 0.2: IC4.25 30.01,10.29 28.75,9.03 JP2.2 28.75,7.34 29.4,6.7 31.9,6.7 JP5.7 33.23,4.97 34.55,3.65 R8.P$1
TX_EN
  Top 0.2: IC2.20 9.25,15.8 LED3.A
TXD  (via drill 0.3)
  Top 0.2: v35.4,10.8 35.23,10.97 IC4.32
  Bottom 0.2: v35.4,10.8 35.4,10.2 35.8,9.8 41.5,9.8 42.1,10.4 SJ1.2
VCC1V8  (via drill 0.3)
  Top 0.2: v28,10.5 28,12.3 28.37,12.67 IC4.23 | v19.6,14.5 19.5,14.4 19.5,11.5 v19.4,11.4 | v6.5,9.6 IC1.5 5.3,9.04 C1.P$2
  Bottom 0.2: 19.4,9.2 8.1,9.2 7.7,9.6 v6.5,9.6 | 19.4,9.2 25.2,9.2 26.5,10.5 v28,10.5 | v19.4,11.4 19.4,9.2 | v19.6,14.5 20.1,15 SJ8.3
VCC15  (via drill 0.3)
  Top 0.2: 18.4,9.6 v18.4,9.8 | 24.2,9.9 R1.P$2 | 37.4,10.3 v37.5,10.4 | v37.5,10.4 37.6,10.3 R7.P$2 | 38.8,11.2 38.7,11.2 | v7.4,10.2 7.24,10.36 IC1.4 | IC4.29 32.63,10 v32.7,10 32.85,9.85 C20.P$2 | C2.P$2 8.5,19.9 8.4,19.8 IC7.3 IC7.2 7.95,18.05 v7.4,17.5 | LED2.A 40,16.05 v40,15.2 | 34.3,9.2 34.4,9.1 | v37.5,10.4 37.5,8.04 JP2.9 37.65,7.25 38.3,6.6 39.62,6.6 JP5.1 | R8.P$2 35.95,1.2 v36.5,1.2 | IC4.6 36.27,15.26 36.75,15.75 C6.P$2 37.95,15.75 v38.7,15
  Top 0.25: IC2.8 15.45,16.8 15.45,16.7 | IC2.6 14.8,15.8 v14.8,15.9
  Top 0.5: v44.2,16 46.4,13.8 | 46.4,13.8 47.9,12.3 v47.9,12 IC3.6_V_BCKP | v40,15.2 40,14.65 R6.P$1 40.25,13.85 39.7,13.3 39.7,12.35 Q2.2 38.7,11.2 R15.P$2 37.75,10.65 v37.5,10.4 | v32.7,10 32.7,9.7 33.3,9.1 34.4,9.1 34.8,9.1 v36.1,10.4 | v25.8,10.7 24.75,10.7 | 24.75,10.7 C13.P$2 | 24.75,10.7 24.2,10.15 | 24.2,10.15 R1.P$2 | 24.2,10.15 23.72,9.67 IC5.6 | IC5.6 IC5.7 | IC5.6 23,9.7 22,9.7 21.8,9.5 18.8,9.5 | 18.8,9.5 18.7,9.5 v18.4,9.8 | IC5.4 18.32,9.02 18.8,9.5 | 15.3,13.35 L5.1 | v14.8,15.9 15.1,16.2 C15.P$1 15.45,16.7 C16.P$1 | L5.1 15.4,14.7 v15.5,14.8 14.95,14.8 C17.P$1 14.75,15.8 14.8,15.8 | v14.6,9.8 14.7,9.9 14.7,10.8 14.5,11 14.5,12.45 C11.P$2 14.55,12.85 L5.1 | v49.8,17.2 46.4,13.8
  Bottom 0.18: 9.45,16.8 13.5,16.8
  Bottom 0.2: 13.5,16.8 14.4,15.9 v14.8,15.9 | v14.6,9.8 14.4,9.6 8.3,9.6 7.7,10.2 v7.4,10.2 | v36.5,1.2 41.1,1.2 42,2.1 42,4.22 JP5.1 | v15.5,14.8 16,15.3 19.7,15.3 20.1,15.7 22.4,15.7 22.6,15.5 SJ8.1 | 9.45,16.8 8.75,17.5 v7.4,17.5
  Bottom 0.5: v36.1,10.4 v37.5,10.4 | v32.7,10 32.7,10.5 31.9,11.3 26.4,11.3 v25.8,10.7 | v18.4,9.8 v14.6,9.8 | SJ5.2 v47.9,12 | v38.7,15 39.8,15 v40,15.2 40.5,15.7 43.9,15.7 v44.2,16 | SJ6.2 49.9,17.3 v49.8,17.2
VCXO_CTRL
  Top 0.2: IC4.21 27.73,13.97 26.9,14.8 26.9,16 27.6,16.7 27.6,19 27.05,19.55 R10.P$2
VCXO_EN  (via drill 0.3)
  Top 0.2: 26.05,20.1 21,20.1 20.7,19.8 VCXO.2 VCXO.2INNER | 26.05,20.1 31.1,20.1 v31.4,19.8 | v35.6,19.9 35.6,19.3 34.59,18.29 IC4.9 | R16.P$2 26.05,20.1
  Bottom 0.2: v31.4,19.8 32.6,19.8 32.9,20.1 35.4,20.1 v35.6,19.9
VSOLAR  (via drill 0.3)
  Top 0.2: L1.1_6 L1.1_2 L1.1_4 L1.1_8 L1.1_1 | L1.1_1 L1.1_9 L1.1_5 L1.1_3 L1.1_7 | IC5.1 18.18,10.97 v18.5,11.3 | v13.9,10.5 13.43,10.5 L1.1_1 | IC5.8 23,11 | IC5.8 23.05,10.95 | C12.P$2 18.65,11.45 v18.5,11.3 | R17.P$2 23.35,10.97 IC5.8 | IC5.8 19.88,10.97 19.6,10.7 19.2,10.7 18.6,11.3 v18.5,11.3
  Top 0.5: L1.1_6 13.1,10.3 v10.9,10.3
  Top 0.6: 13.23,9.45 L1.1_1
  Bottom 0.2: v18.5,11.3 17.7,10.5 v13.9,10.5
  Bottom 0.5: v10.9,10.3 8.4,10.3 7.7,11 6.7,11 4.65,8.85 2.35,8.85 JP3.1
  other vias: 1.1,10.1
(copper drawn outside any net)
  shapes: Bottom area x5

### Text on the board
Top: Version 02. November 2015